# EAGLE design hello_radio (EAGLE 4.16)
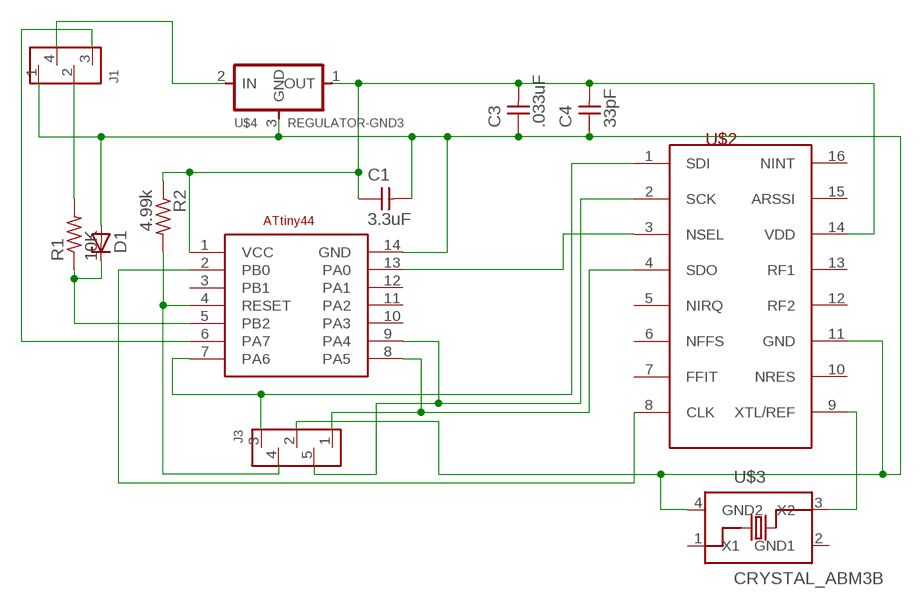
[diagram p0: schematic, sheet 1]

## Parts
C1  3.3uF  UNPOLARIZED_CAPACITOR1206  [1206]
C3  .033uF  UNPOLARIZED_CAPACITOR1206  [1206]
C4  33pF  UNPOLARIZED_CAPACITOR1206  [1206]
D1  ZENER_DIODESOD123  [SOD123]
J1  MTA_4MTA_4  [MTA_4]
J3  MTA_5MTA_5  [MTA_5]
R1  10K  RESISTOR1206  [1206]
R2  4.99k  RESISTOR1206  [1206]
U$1  ATTINY44  [SO14]
U$2  IA4421  [TSSOP16]
U$3  CRYSTAL_ABM3B  [ABM3B]
U$4  REGULATOR-GND3  [SOT-23]

## Nets
N$1: J3.1 U$1.8(PA5) U$2.4(SDO)
N$2: J1.4 U$4.2(IN)
N$3: J3.3 U$1.7(PA6) U$2.1(SDI)
N$4: J3.5 U$1.9(PA4) U$2.2(SCK)
N$5: C1.2 C3.1 C4.1 D1.ANODE J1.1 J3.2 U$1.14(GND) U$2.11(GND) U$3.4(GND2) U$4.3(GND)
N$6: U$1.13(PA0) U$2.3(NSEL)
N$7: J1.3 U$1.6(PA7)
N$8: J3.4 R2.2 U$1.4(RESET)
N$9: D1.CATHODE R1.1 U$1.5(PB2)
N$11: J1.2 R1.2
N$13: U$1.2(PB0) U$2.8(CLK)
N$14: U$2.9(XTL/REF) U$3.3(X2)
N$16: C1.1 C3.2 C4.2 R2.1 U$1.1(VCC) U$2.14(VDD) U$4.1(OUT)
Unconnected: U$1.3(PB1) U$1.10(PA3) U$1.11(PA2) U$1.12(PA1) U$2.5(NIRQ) U$2.6(NFFS) U$2.7(FFIT) U$2.10(NRES) U$2.12(RF2) U$2.13(RF1) U$2.15(ARSSI) U$2.16(NINT) U$3.1(X1) U$3.2(GND1)

## Library data of the parts
C1 C3 C4 = ng:UNPOLARIZED_CAPACITOR: unpolarized_capacitor
D1 = ng:ZENER_DIODE: zener diode
J1 = ng:MTA_4
J3 = ng:MTA_5
R1 R2 = ng:RESISTOR
U$1 = cfd:ATTINY44
U$2 = cfd:IA4421
U$3 = cfd:CRYSTAL_ABM3B
U$4 = cfd:REGULATOR-GND3

## Board
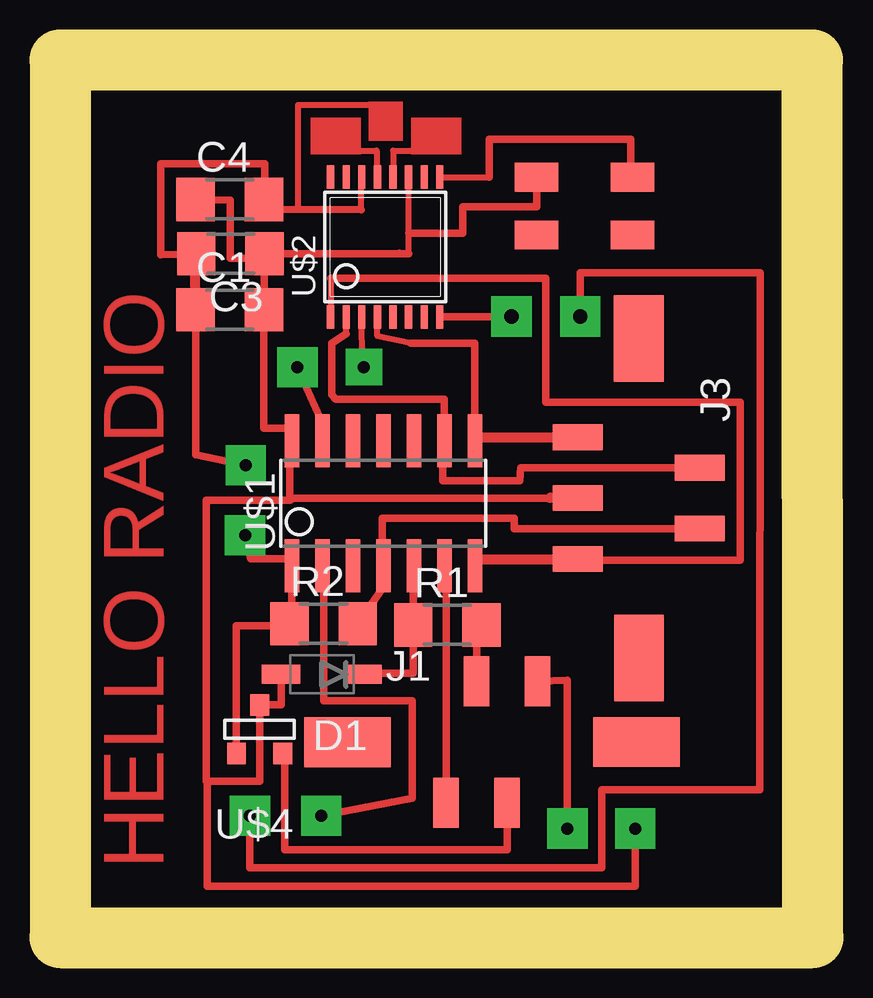
[diagram p1: board, top side]
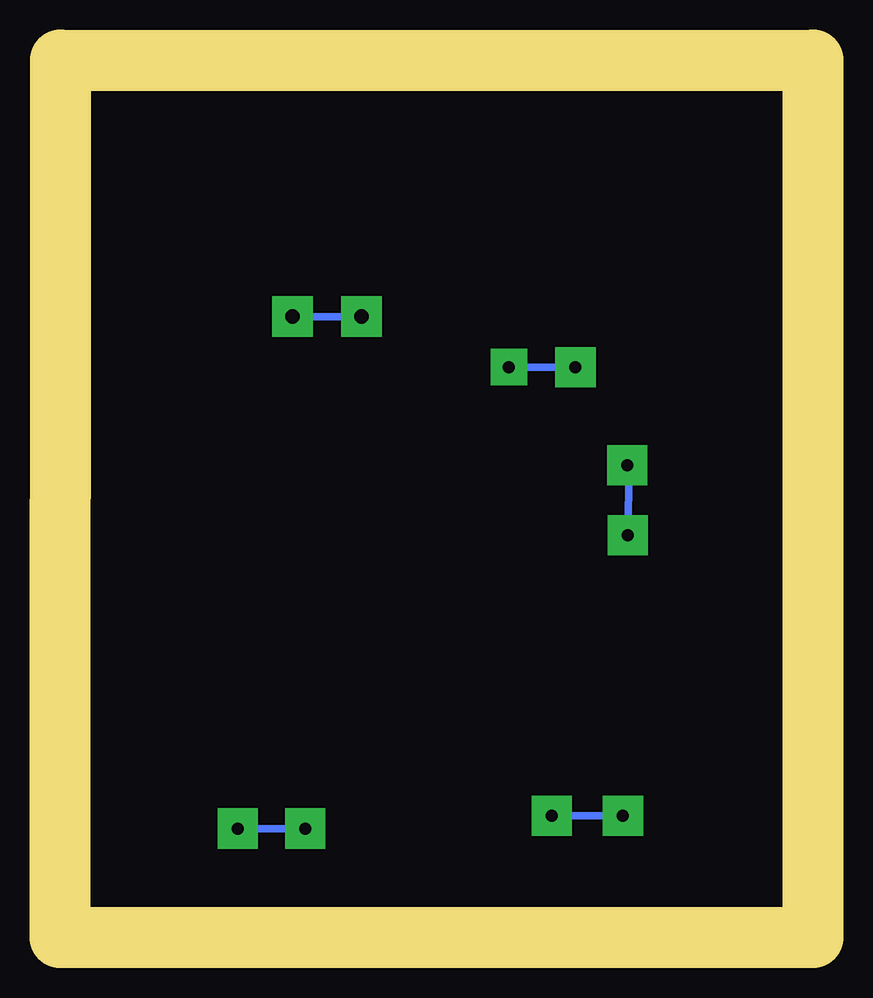
[diagram p2: board, bottom side, seen from below]

Size 31.37 x 36.57 mm. Coordinates in mm from the lower left corner, seen from the top.
Outline: 0,0 31.37,0 31.34,36.57 0,36.57 0,0
Copper layers (1*16): Top 0.035mm / dielectric 1.5mm / Bottom 0.035mm
Design rules "default": minimum track width 10mil, minimum drill 24mil, track to track 16mil, track to pad 16mil, pad to pad 16mil, via to via 16mil, smd to smd 0mil, copper to edge 40mil, drill to drill 8mil, minimum pad ring 10mil, minimum via ring 8mil, stop-mask expansion 4mil, vias tented up to drill 0mil, thermal gap 10mil

### Footprints (pad centres in the part's own frame; a part is rotated, then mirrored left to right if it is on the bottom)
1206 = smd 1.6 x 1.803: 1 -1.422,0; 2 1.422,0
SOD123 = smd 1.6 x 0.8: ANODE 1.7,0; CATHODE -1.7,0
MTA_4 = smd 1.067 x 2.083: 1 -1.905,-2.54; 2 0.635,-2.54; 3 1.905,2.54; 4 -0.635,2.54 | smd 3.607 x 2.057: P$5 -6.02,0 | smd 3.607 x 2.083: P$6 6.02,0
MTA_5 = smd 1.067 x 2.083: 1 2.54,2.54; 2 0,2.54; 3 -2.54,2.54; 4 -1.27,-2.54; 5 1.27,-2.54 | smd 3.607 x 2.057: P$5 -6.655,0 | smd 3.607 x 2.083: P$6 6.655,0
SO14 = smd 0.61 x 2.21: 1 -3.81,-2.603; 2 -2.54,-2.603; 3 -1.27,-2.603; 4 0,-2.603; 5 1.27,-2.603; 6 2.54,-2.603; 7 3.81,-2.603; 8 3.81,2.603; 9 2.54,2.603; 10 1.27,2.603; 11 0,2.603; 12 -1.27,2.603; 13 -2.54,2.603; 14 -3.81,2.603
TSSOP16 = smd 0.305 x 0.991: 1 -2.275,-2.918; 2 -1.625,-2.918; 3 -0.975,-2.918; 4 -0.325,-2.918; 5 0.325,-2.918; 6 0.975,-2.918; 7 1.625,-2.918; 8 2.275,-2.918; 9 2.275,2.918; 10 1.625,2.918; 11 0.975,2.918; 12 0.325,2.918; 13 -0.325,2.918; 14 -0.975,2.918; 15 -1.625,2.918; 16 -2.275,2.918
ABM3B = smd 1.8 x 1.2: 1 -2,-1.2; 2 2,-1.2; 3 2,1.2; 4 -2,1.2
SOT-23 = smd 0.787 x 0.889: 1 0.991,1.016; 2 -0.94,1.016; 3 0.025,-1.016

### Placement (x,y rotation side)
C1  7.07,26.16 0 top
C3  7.1,28.49 180 top
C4  7.07,30.75 0 top
D1  10.91,10.97 180 top
J1  18,8.15 180 top
J3  24.12,18.31 90 top
R1  16.14,13.03 0 top
R2  10.99,13.08 0 top
U$1  13.47,18.11 0 top
U$2  13.55,28.77 0 top
U$3  21.86,30.48 0 top
U$4  8.34,8.68 180 top

### Tracks (layer width: path | path; a pad name or v marks a point on that pad's centre or on a via)
N$1
  Top 0.254: 14.62,24.76 13.22,25.06 U$2.4
  Top 0.305: 14.62,24.76 17.28,24.76 17.28,20.95 | U$1.8 17.28,20.95 | 17.28,20.95 17.39,20.95
  Top 0.406: 17.21,20.96 17.21,21.05 | U$1.8 17.21,20.96 | J3.1 17.21,20.85 17.21,20.96
N$2
  Top 0.305: J1.4 18.63,3.65 9.36,3.65 9.36,7.51 9.28,7.51 U$4.2
N$3
  Top 0.254: 11.28,27.48 U$2.1
  Top 0.305: 11.28,27.48 20.23,27.48 20.23,22.3 28.33,22.3 28.33,15.72 21.58,15.72 | 21.58,15.72 21.48,15.72 | J3.3 21.58,15.72
  Top 0.406: 17.26,15.76 17.26,15.54 | U$1.7 17.26,15.76 | J3.3 17.26,15.77 17.26,15.76
N$4
  Top 0.254: 11.93,25.17 U$2.2
  Top 0.305: J3.5 19.19,19.58 19.16,19.04 15.94,19.04 15.96,20.42 | U$1.9 15.96,20.96 15.96,20.42 | 11.93,25.17 11.32,24.76 11.32,22.63 11.49,22.42 16.01,22.42 16.01,20.42 15.96,20.42
N$5  (via drill 0.5 pad 1.68)
  Top 0.254: 14.53,28.49 14.53,29.36 U$2.11
  Top 0.305: 20.43,18.33 21.02,18.33 | 9.56,18.31 20.41,18.31 | 9.56,18.31 9.59,20.96 | 9.56,18.31 9.59,18.23 6.08,18.23 6.08,6.57 | C3.1 C1.2 8.5,21.23 9.66,21.23 U$1.14 | C3.1 8.47,28.14 8.39,28.14 | C4.1 7.1,30.73 7.1,28.32 8.62,28.32 8.72,28.09 C3.1 | C3.1 8.47,28.49 | C3.1 14.14,28.49 | 14.14,28.49 14.53,28.49 | 14.14,28.49 14.14,28.52 | D1.ANODE 9.21,9.7 U$4.3 8.32,6.52 6.08,6.52 6.08,6.57 | J1.1 21.15,10.71 v21.15,4.54 | 6.08,6.57 6.13,6.57 6.13,2.13 23.96,2.13 v23.96,4.54 | U$3.4 19.86,30.45 16.78,30.45 16.78,29.36 14.53,29.36
  Top 0.406: J3.2 21.02,18.33 21.22,18.41 | 20.41,18.31 20.43,18.33 | 9.59,21.05 9.59,20.96 U$1.14
  Bottom 0.305: v23.96,4.54 v21.15,4.54
N$6  (via drill 0.5 pad 1.52, 0.5 pad 1.68)
  Top 0.254: 12.6,23.95 U$2.3
  Top 0.305: v12.66,23.77 12.6,23.95 | 10.99,20.95 10.93,20.95 U$1.13 | 10.99,20.95 10.83,21.69 v9.89,23.77 | 10.99,20.95 11.06,20.95
  Bottom 0.305: v12.66,23.77 v9.89,23.77 9.99,24.23
N$7
  Top 0.305: U$1.6 16.01,15.26 16.09,15.21 J1.3
N$8
  Top 0.305: J3.4 18.94,17.04 18.94,17.47 13.42,17.47 13.42,15.76 | 13.4,15.76 13.4,16.02 | 13.4,15.76 U$1.4 | R2.2 13.58,14.75 13.4,15.76
  Top 0.406: 13.42,15.59 13.42,15.76 U$1.4
N$9
  Top 0.305: U$1.5 14.74,15.54 14.77,15.54 14.77,15.23 14.72,15.23 R1.1 14.72,11.02 12.61,11.02 | 12.61,11.02 12.59,11.02 | D1.CATHODE 12.61,11.02
N$11
  Top 0.305: 17.56,12.39 17.61,12.39 | 17.56,12.39 R1.2 | J1.2 17.36,12.39 17.56,12.39
N$13  (via drill 0.5 pad 1.68, 0.6 pad 1.68)
  Top 0.254: 15.83,25.88 U$2.8
  Top 0.305: v18.81,25.88 15.83,25.88 | v21.68,25.88 21.68,27.71 29.17,27.71 29.15,6.17 22.57,6.17 22.57,2.92 7.91,2.92 v7.91,5.07 | 10.99,15.84 10.93,15.84 U$1.2 10.99,15.76 10.99,15.84 | 10.99,15.84 11.06,15.84 | 10.99,15.84 10.99,9.88 14.67,9.88 14.67,5.81 v10.88,5.07
  Bottom 0.305: v21.68,25.88 v18.81,25.88 | v7.91,5.07 v10.88,5.07
N$14
  Top 0.254: U$2.9 17.89,31.69
  Top 0.305: 17.89,31.69 17.89,33.27 23.79,33.27 23.79,31.67 U$3.3
N$16  (via drill 0.5 pad 1.68)
  Top 0.254: 12.56,31.44 12.56,31.49 | 12.56,31.44 U$2.14 | 12.56,30.32 12.56,31.44
  Top 0.305: C3.2 4.2,28.44 4.2,32.25 8.52,32.25 8.52,30.35 | 8.52,30.35 8.52,30.3 | 8.52,30.35 C4.2 8.6,30.75 8.6,30.35 12.56,30.32 | 9.44,13 9.51,13 | 9.44,13 R2.1 9.66,13.08 | U$4.1 7.35,13 9.44,13 | 9.66,13.08 U$1.1 9.66,15.79 7.94,15.79 v7.71,16.76 | 9.66,13.08 9.74,13.08 | C1.1 5.65,20.11 v7.73,19.68
  Top 0.406: 5.63,28.04 C3.2 | C1.1 5.63,28.04 | 5.63,28.04
  Bottom 0.305: v7.73,19.68 7.66,19.58 v7.71,16.76
N$17
  Top 0.254: 13.2,31.92 13.2,32.79 11.95,32.79
N$19
  Top 0.254: 13.88,31.87 13.88,32.79 15.18,32.79
N$20
  Top 0.254: 9.92,30.5 9.92,34.69 13.55,34.69 13.55,33.5 13.6,33.5 13.58,33.85 13.73,33.85
(copper drawn outside any net)
  shapes: Top area x3

### Text on the board
Top: HELLO RADIO